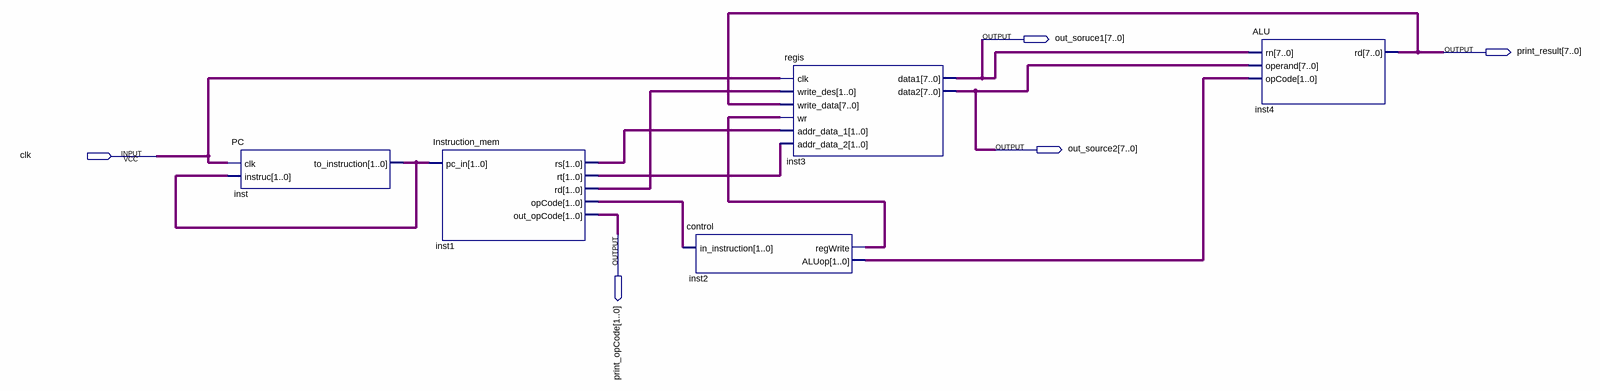
[diagram p0: schematic sheet]
// Quartus schematic com_procress.bdf as structural Verilog: 5 symbols, 5 pins
module com_procress (
  input  clk,
  output [7:0] out_soruce1,
  output [7:0] print_result,
  output [7:0] out_source2,
  output [1:0] print_opCode
);

  wire inst2_regwrite;
  wire [1:0] inst1_opcode, inst1_rd, inst1_rs, inst1_rt, inst2_aluop, inst_to_instruction;

  PC inst (.clk(clk), .instruc(inst_to_instruction), .to_instruction(inst_to_instruction));
  Instruction_mem inst1 (
    .pc_in(inst_to_instruction), .rs(inst1_rs), .rt(inst1_rt), .rd(inst1_rd), .opCode(inst1_opcode),
    .out_opCode(print_opCode));
  control inst2 (.in_instruction(inst1_opcode), .regWrite(inst2_regwrite), .ALUop(inst2_aluop));
  regis inst3 (
    .clk(clk), .write_des(inst1_rd), .write_data(print_result), .wr(inst2_regwrite), .addr_data_1(inst1_rs),
    .addr_data_2(inst1_rt), .data1(out_soruce1), .data2(out_source2));
  ALU inst4 (.rn(out_soruce1), .operand(out_source2), .opCode(inst2_aluop), .rd(print_result));
endmodule
